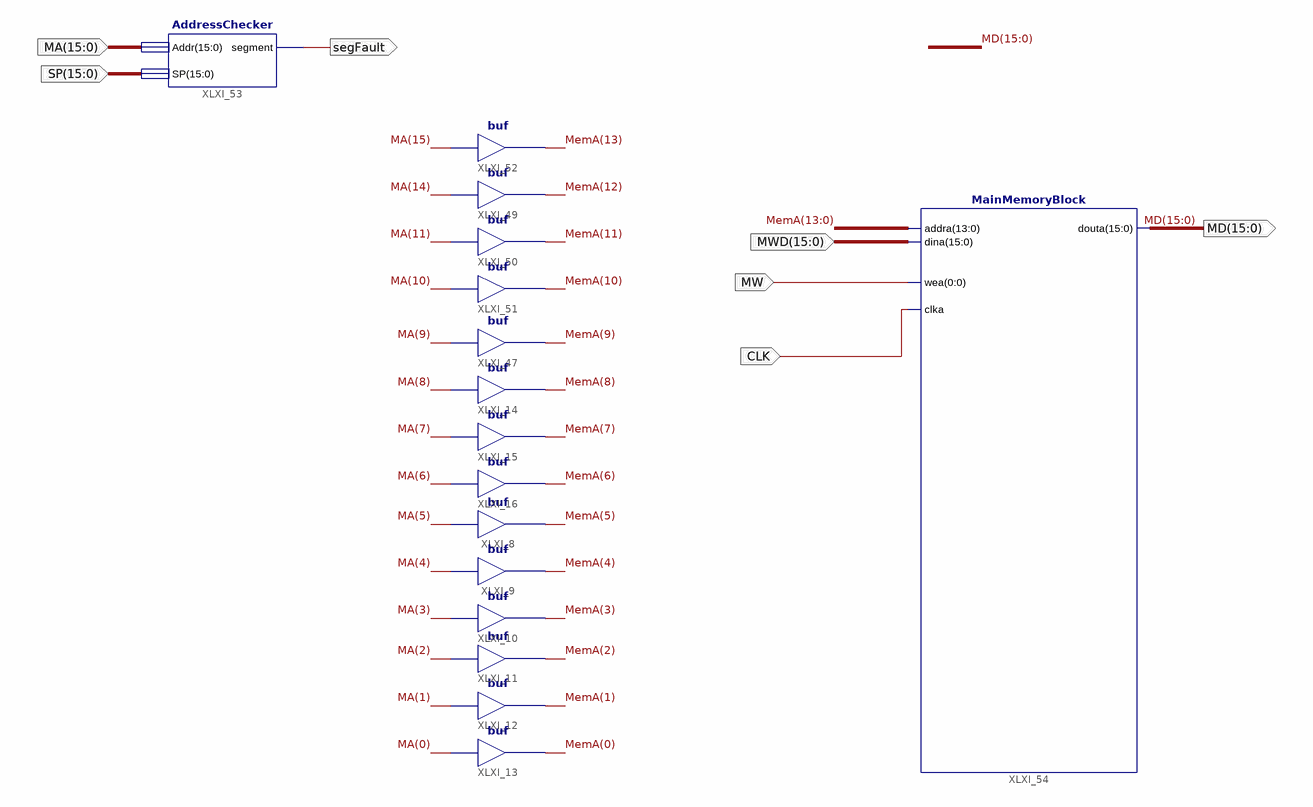
[diagram p0: schematic sheet 1]
// Xilinx ISE schematic Memory.sch (spartan3e) as structural Verilog: 16 symbols, 7 ports
module Memory (
  input  [15:0] MA,
  input  MW,
  input  [15:0] MWD,
  input  [15:0] SP,
  input  CLK,
  output [15:0] MD,
  output segFault
);

  wire [13:0] MemA;

  AddressChecker XLXI_53 (.Addr(MA), .SP(SP), .segment(segFault));
  buf XLXI_12 (MemA[1], MA[1]);
  buf XLXI_13 (MemA[0], MA[0]);
  buf XLXI_11 (MemA[2], MA[2]);
  buf XLXI_8 (MemA[5], MA[5]);
  buf XLXI_9 (MemA[4], MA[4]);
  buf XLXI_10 (MemA[3], MA[3]);
  buf XLXI_14 (MemA[8], MA[8]);
  buf XLXI_15 (MemA[7], MA[7]);
  buf XLXI_16 (MemA[6], MA[6]);
  buf XLXI_47 (MemA[9], MA[9]);
  buf XLXI_49 (MemA[12], MA[14]);
  buf XLXI_50 (MemA[11], MA[11]);
  buf XLXI_51 (MemA[10], MA[10]);
  buf XLXI_52 (MemA[13], MA[15]);
  MainMemoryBlock XLXI_54 (.addra(MemA), .dina(MWD), .wea(MW), .clka(CLK), .douta(MD));
endmodule
